# EAGLE schematic venti_ver2.0 (EAGLE 9.5.2)
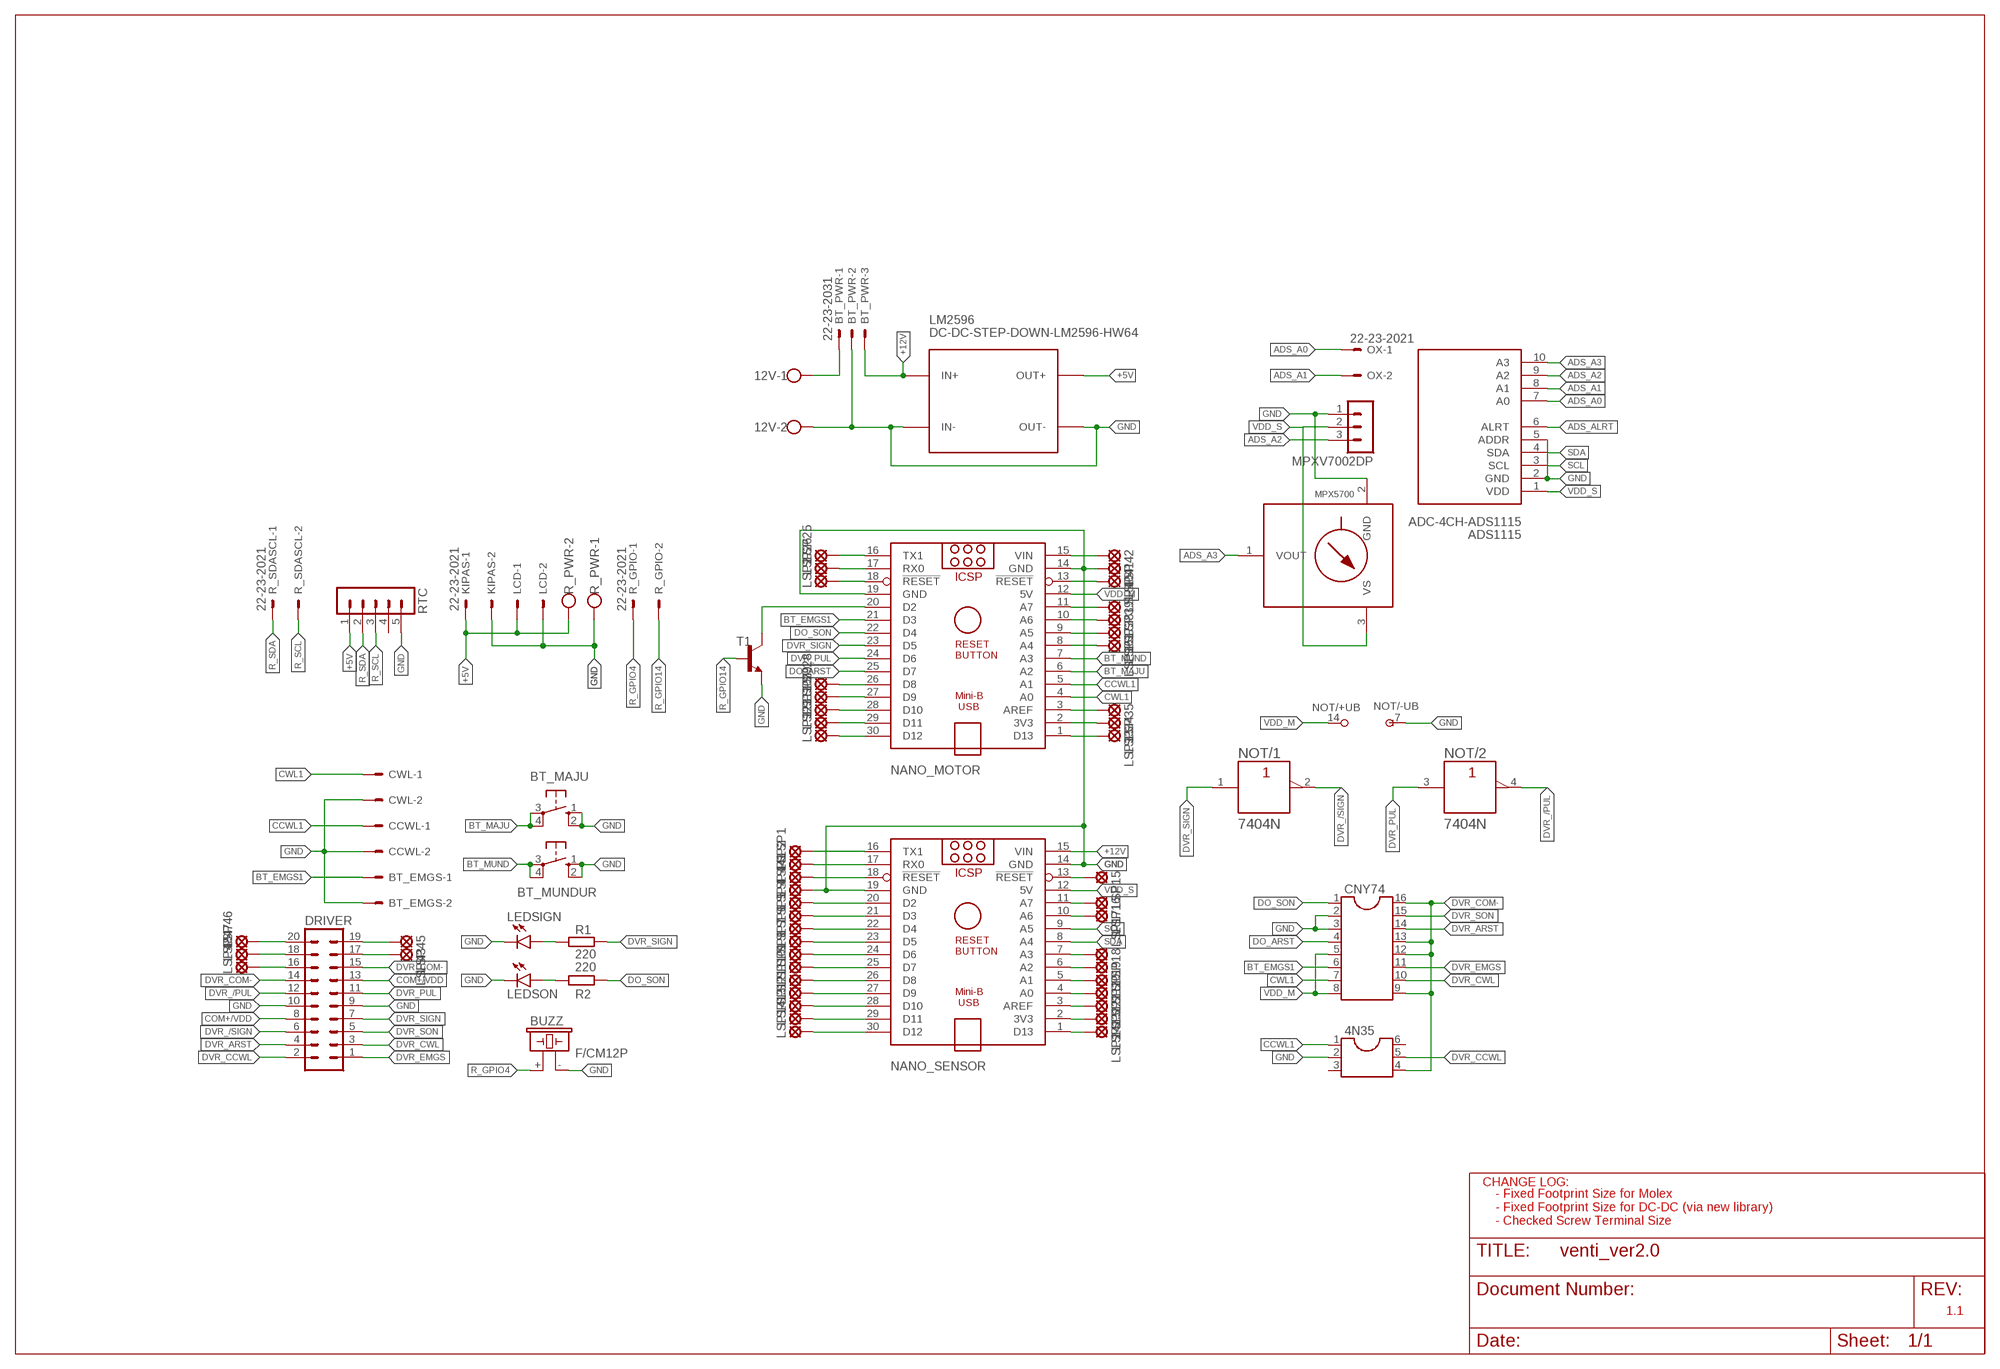
[diagram p0: schematic, sheet 1]

## Parts
4N35  DIL6  [DIL06]
12V  W237-102  [W237-102]
ADS1115  ADC-4CH-ADS1115  [ADC-4CH-ADS1115]
BT_EMGS  22-23-2021  [22-23-2021]
BT_MAJU  40-XX  [B3F-40XX]
BT_MUNDUR  40-XX  [B3F-40XX]
BT_PWR  22-23-2031  [22-23-2031]
BUZZ  F/CM12P  [F/CM12P]
CCWL  22-23-2021  [22-23-2021]
CNY74  DIL16  [DIL16]
CWL  22-23-2021  [22-23-2021]
DRIVER  ML20  [ML20]
KIPAS  22-23-2021  [22-23-2021]
LCD  22-23-2021  [22-23-2021]
LEDSIGN  LED5MM  [LED5MM]
LEDSON  LED5MM  [LED5MM]
LM2596  DC-DC-STEP-DOWN-LM2596-HW64  [DC-DC-STEP-DOWN-LM2596]
LSP1  LSP11  [LSP11]
LSP2  LSP11  [LSP11]
LSP3  LSP11  [LSP11]
LSP4  LSP11  [LSP11]
LSP5  LSP11  [LSP11]
LSP6  LSP11  [LSP11]
LSP7  LSP11  [LSP11]
LSP8  LSP11  [LSP11]
LSP9  LSP11  [LSP11]
LSP10  LSP11  [LSP11]
LSP11  LSP11  [LSP11]
LSP12  LSP11  [LSP11]
LSP13  LSP11  [LSP11]
LSP14  LSP11  [LSP11]
LSP15  LSP11  [LSP11]
LSP16  LSP11  [LSP11]
LSP17  LSP11  [LSP11]
LSP18  LSP11  [LSP11]
LSP19  LSP11  [LSP11]
LSP20  LSP11  [LSP11]
LSP21  LSP11  [LSP11]
LSP22  LSP11  [LSP11]
LSP23  LSP11  [LSP11]
LSP24  LSP11  [LSP11]
LSP25  LSP11  [LSP11]
LSP26  LSP11  [LSP11]
LSP27  LSP11  [LSP11]
LSP28  LSP11  [LSP11]
LSP29  LSP11  [LSP11]
LSP30  LSP11  [LSP11]
LSP31  LSP11  [LSP11]
LSP32  LSP11  [LSP11]
LSP33  LSP11  [LSP11]
LSP34  LSP11  [LSP11]
LSP35  LSP11  [LSP11]
LSP36  LSP11  [LSP11]
LSP37  LSP11  [LSP11]
LSP38  LSP11  [LSP11]
LSP39  LSP11  [LSP11]
LSP40  LSP11  [LSP11]
LSP41  LSP11  [LSP11]
LSP42  LSP11  [LSP11]
LSP43  LSP11  [LSP11]
LSP44  LSP11  [LSP11]
LSP45  LSP11  [LSP11]
LSP46  LSP11  [LSP11]
LSP47  LSP11  [LSP11]
LSP48  LSP11  [LSP11]
MPX5700  MPX-867B-H  [867B-H]
MPXV7002DP  MA03-1  [MA03-1]
NANO_MOTOR  ARDUINO_NANO  [ARDUINO_NANO]
NANO_SENSOR  ARDUINO_NANO  [ARDUINO_NANO]
NOT  7404N  [DIL14]
OX  22-23-2021  [22-23-2021]
R1  220  R-EU_0204/7  [0204/7]
R2  220  R-EU_0204/7  [0204/7]
R_GPIO  22-23-2021  [22-23-2021]
R_PWR  W237-102  [W237-102]
R_SDASCL  22-23-2021  [22-23-2021]
RTC  MA05-1  [MA05-1]
T1  2N2222-NPN-TO92-EBC  [TO92-EBC]

## Nets
+5V: KIPAS.1 LCD.1 LM2596.OUT+ R_PWR.2 RTC.1
+12V: BT_PWR.3 LM2596.IN+ NANO_SENSOR.15(VIN)
ADS_A0: ADS1115.7(A0) OX.1
ADS_A1: ADS1115.8(A1) OX.2
ADS_A2: ADS1115.9(A2) MPXV7002DP.3
ADS_A3: ADS1115.10(A3) MPX5700.1(VOUT)
ADS_ALRT: ADS1115.6(ALRT)
BT_EMGS1: BT_EMGS.1 CNY74.6 NANO_MOTOR.21(D3)
BT_MAJU: BT_MAJU.3(P) BT_MAJU.4(P1) NANO_MOTOR.6(A2)
BT_MUND: BT_MUNDUR.3(P) BT_MUNDUR.4(P1) NANO_MOTOR.7(A3)
CCWL1: 4N35.1 CCWL.1 NANO_MOTOR.5(A1)
COM+/VDD: DRIVER.8 DRIVER.13
CWL1: CNY74.7 CWL.1 NANO_MOTOR.4(A0)
DO_ARST: CNY74.4 NANO_MOTOR.25(D7)
DO_SON: CNY74.1 NANO_MOTOR.22(D4) R2.2
DVR_/PUL: DRIVER.12 NOT.4(/2:Y)
DVR_/SIGN: DRIVER.6 NOT.2(/1:Y)
DVR_ARST: CNY74.14 DRIVER.4
DVR_CCWL: 4N35.5 DRIVER.2
DVR_COM-: 4N35.4 CNY74.9 CNY74.12 CNY74.13 CNY74.16 DRIVER.14 DRIVER.15
DVR_CWL: CNY74.10 DRIVER.3
DVR_EMGS: CNY74.11 DRIVER.1
DVR_PUL: DRIVER.11 NANO_MOTOR.24(D6) NOT.3(/2:A)
DVR_SIGN: DRIVER.7 NANO_MOTOR.23(D5) NOT.1(/1:A) R1.2
DVR_SON: CNY74.15 DRIVER.5
GND: 4N35.2 12V.2 ADS1115.2(GND) ADS1115.5(ADDR) BT_EMGS.2 BT_MAJU.1(S) BT_MAJU.2(S1) BT_MUNDUR.1(S) BT_MUNDUR.2(S1) BT_PWR.2 BUZZ.- CCWL.2 CNY74.2 CNY74.3 CWL.2 DRIVER.9 DRIVER.10 KIPAS.2 LCD.2 LEDSIGN.K(C) LEDSON.K(C) LM2596.IN- LM2596.OUT- LSP41.MP LSP44.MP MPX5700.2(GND) MPXV7002DP.1 NANO_MOTOR.14(GND) NANO_MOTOR.19(GND) NANO_SENSOR.14(GND) NANO_SENSOR.19(GND) NOT.7(/-UB:-UB) R_PWR.1 RTC.5 T1.E
N$1: NANO_MOTOR.20(D2) T1.C
N$2: LEDSIGN.A R1.1
N$3: LEDSON.A R2.1
N$4: 12V.1 BT_PWR.1
N$5: LSP1.MP NANO_SENSOR.16(TX1)
N$6: LSP2.MP NANO_SENSOR.17(RX0)
N$7: LSP3.MP NANO_SENSOR.18(!RESET)
N$8: LSP4.MP NANO_SENSOR.20(D2)
N$9: LSP5.MP NANO_SENSOR.21(D3)
N$10: LSP6.MP NANO_SENSOR.22(D4)
N$11: LSP7.MP NANO_SENSOR.23(D5)
N$12: LSP8.MP NANO_SENSOR.24(D6)
N$13: LSP9.MP NANO_SENSOR.25(D7)
N$14: LSP10.MP NANO_SENSOR.26(D8)
N$15: LSP11.MP NANO_SENSOR.27(D9)
N$16: LSP12.MP NANO_SENSOR.28(D10)
N$17: LSP13.MP NANO_SENSOR.29(D11)
N$18: LSP14.MP NANO_SENSOR.30(D12)
N$19: LSP15.MP NANO_SENSOR.13(!RESET)
N$20: LSP16.MP NANO_SENSOR.11(A7)
N$21: LSP17.MP NANO_SENSOR.10(A6)
N$22: LSP18.MP NANO_SENSOR.7(A3)
N$23: LSP19.MP NANO_SENSOR.6(A2)
N$24: LSP20.MP NANO_SENSOR.5(A1)
N$25: LSP21.MP NANO_SENSOR.4(A0)
N$26: LSP22.MP NANO_SENSOR.3(AREF)
N$27: LSP23.MP NANO_SENSOR.2(3V3)
N$28: LSP24.MP NANO_SENSOR.1(D13)
N$29: LSP25.MP NANO_MOTOR.16(TX1)
N$30: LSP26.MP NANO_MOTOR.17(RX0)
N$31: LSP27.MP NANO_MOTOR.18(!RESET)
N$32: LSP28.MP NANO_MOTOR.26(D8)
N$33: LSP29.MP NANO_MOTOR.27(D9)
N$34: LSP30.MP NANO_MOTOR.28(D10)
N$35: LSP31.MP NANO_MOTOR.29(D11)
N$36: LSP32.MP NANO_MOTOR.30(D12)
N$37: LSP33.MP NANO_MOTOR.1(D13)
N$38: LSP34.MP NANO_MOTOR.2(3V3)
N$39: LSP35.MP NANO_MOTOR.3(AREF)
N$40: LSP36.MP NANO_MOTOR.8(A4)
N$41: LSP37.MP NANO_MOTOR.9(A5)
N$42: LSP38.MP NANO_MOTOR.10(A6)
N$43: LSP39.MP NANO_MOTOR.11(A7)
N$44: LSP40.MP NANO_MOTOR.13(!RESET)
N$45: LSP42.MP NANO_MOTOR.15(VIN)
N$55: DRIVER.17 LSP43.MP
N$56: DRIVER.19 LSP45.MP
N$63: DRIVER.16 LSP48.MP
N$64: DRIVER.18 LSP47.MP
N$65: DRIVER.20 LSP46.MP
R_GPIO4: BUZZ.+ R_GPIO.1
R_GPIO14: R_GPIO.2 T1.B
R_SCL: R_SDASCL.2 RTC.3
R_SDA: R_SDASCL.1 RTC.2
SCL: ADS1115.3(SCL) NANO_SENSOR.9(A5)
SDA: ADS1115.4(SDA) NANO_SENSOR.8(A4)
VDD_M: CNY74.5 CNY74.8 NANO_MOTOR.12(5V) NOT.14(/+UB:+UB)
VDD_S: ADS1115.1(VDD) MPX5700.3(VS) MPXV7002DP.2 NANO_SENSOR.12(5V)
Unconnected: 4N35.3 4N35.6 MPX5700.4(NC) MPX5700.5(NC) MPX5700.6(NC) NOT.5(/3:A) NOT.6(/3:Y) NOT.8(/4:Y) NOT.9(/4:A) NOT.10(/5:Y) NOT.11(/5:A) NOT.12(/6:Y) NOT.13(/6:A) RTC.4

## Notes on the sheet
- CHANGE LOG:
- - Fixed Footprint Size for Molex
  - Fixed Footprint Size for DC-DC (via new library)
  - Checked Screw Terminal Size
- 1.1

## Library data of the parts
4N35 = ic-package:DIL6: Dual In Line / Socket
12V R_PWR = con-wago-500:W237-102: WAGO SCREW CLAMP; MPN: 237-102; OC_FARNELL: unknown; OC_NEWARK: 70K9898
ADS1115 = diy-modules:ADC-4CH-ADS1115: 4 Channel 16-Bit Analog-to-Digital Converter based on ADS1115 chip Arduino ADS1115 Getting Started Tutorial is available here: http://henrysbench.capnfatz.com/henrys-bench/arduino-voltage-measurements/arduino-ads1115-module-getting-started-tutorial/ ADS1115 datasheet is available here: http://www.ti.com/lit/ds/symlink/ads1115.pdf Click here to find device on ebay.com <http://www.ebay.com/sch/ads1115+module>
BT_EMGS CCWL CWL KIPAS LCD OX R_GPIO R_SDASCL = con-molex:22-23-2021: .100" (2.54mm) Center Header - 2 Pin; MF: MOLEX; MPN: 22-23-2021; OC_FARNELL: 1462926; OC_NEWARK: 25C3832
BT_MAJU BT_MUNDUR = switch-omron:40-XX: OMRON SWITCH; MF: OMRON COMPONENTS USA; MPN: B3F-4000; OC_FARNELL: 176434; OC_NEWARK: 36K3105
BT_PWR = con-molex:22-23-2031: .100" (2.54mm) Center Header - 3 Pin; MF: MOLEX; MPN: 22-23-2031; OC_FARNELL: 1462950; OC_NEWARK: 30C0862
BUZZ = buzzer:F/CM12P: BUZZER Source: Buerklin; OC_FARNELL: unknown; OC_NEWARK: unknown
CNY74 = ic-package:DIL16: Dual In Line / Socket
DRIVER = con-harting-ml:ML20: HARTING; OC_FARNELL: unknown; OC_NEWARK: unknown
LEDSIGN LEDSON = led:LED: LED OSRAM: - CHIPLED LG R971, LG N971, LY N971, LG Q971, LY Q971, LO R971, LY R971 LH N974, LH R974 LS Q976, LO Q976, LY Q976 LO Q996 - Hyper CHIPLED LW Q18S LB Q993, LB Q99A, LB R99A - SideLED LS A670, LO A670, LY A670, LG A670, LP A670 LB A673, LV A673, LT A673, LW A673 LH A674 LY A675 LS A676, LA A676, LO A676, LY A676, LW A676 LS A679, LY A679, LG A679 - Hyper Micro SIDELED® LS Y876, LA Y876, LO Y876, LY Y876 LT Y87S - SmartLED LW L88C, LW L88S LB L89C, LB L89S, LG L890 LS L89K, LO L89K, LY L89K LS L896, LA L896, LO L896, LY L896 - TOPLED LS T670, LO T670, LY T670, LG T670, LP T670 LSG T670, LSP T670, LSY T670, LOP T670, LYG T670 LG T671, LOG T671, LSG T671 LB T673, LV T673, LT T673, LW T673 LH T674 LS T676, LA T676, LO T676, LY T676, LB T676, LH T676, LSB T676, LW T676 LB T67C, LV T67C, LT T67C, LS T67K, LO T67K, LY T67K, LW E67C LS E67B, LA E67B, LO E67B, LY E67B, LB E67C, LV E67C, LT E67C LW T67C LS T679, LY T679, LG T679 LS T770, LO T770, LY T770, LG T770, LP T770 LB T773, LV T773, LT T773, LW T773 LH T774 LS E675, LA E675, LY E675, LS T675 LS T776, LA T776, LO T776, LY T776, LB T776 LHGB T686 LT T68C, LB T68C - Hyper Mini TOPLED® LB M676 - Mini TOPLED Santana® LG M470 LS M47K, LO M47K, LY M47K Source: http://www.osram.convergy.de LUXEON: - LUMILED® LXK2-PW12-R00, LXK2-PW12-S00, LXK2-PW14-U00, LXK2-PW14-V00 LXK2-PM12-R00, LXK2-PM12-S00, LXK2-PM14-U00 LXK2-PE12-Q00, LXK2-PE12-R00, LXK2-PE12-S00, LXK2-PE14-T00, LXK2-PE14-U00 LXK2-PB12-K00, LXK2-PB12-L00, LXK2-PB12-M00, LXK2-PB14-N00, LXK2-PB14-P00, LXK2-PB14-Q00 LXK2-PR12-L00, LXK2-PR12-M00, LXK2-PR14-Q00, LXK2-PR14-R00 LXK2-PD12-Q00, LXK2-PD12-R00, LXK2-PD12-S00 LXK2-PH12-R00, LXK2-PH12-S00 LXK2-PL12-P00, LXK2-PL12-Q00, LXK2-PL12-R00 Source: www.luxeon.com KINGBRIGHT: KA-3528ASYC Source: www.kingbright.com
LM2596 = lm2596-HW64-pras:DC-DC-STEP-DOWN-LM2596-HW64: DC/DC Step-Down Regulator based on LM2596-ADJ chip Modified DC/DC Step Down Regulator by Prasetyo W. to accomodate for LM2596 HW-64 alternative. Length 53.52 Width 24.11
LSP1-LSP48 = solpad:LSP11: SOLDER PAD drill 1.1 mm
MPX5700 = mpx-freescale:MPX*****: Generic MPX pressure sensor
MPXV7002DP = con-lstb:MA03-1: PIN HEADER; OC_FARNELL: unknown; OC_NEWARK: unknown
NANO_MOTOR NANO_SENSOR = ArduinoNanoV30:ARDUINO_NANO: Arduino Nano V3.0 Overview: The Arduino Nano is a small, complete, and breadboard-friendly board based on the ATmega328 (Arduino Nano 3.x) or ATmega168 (Arduino Nano 2.x). It has more or less the same functionality of the Arduino Duemilanove, but in a different package. It lacks only a DC power jack, and works with a Mini-B USB cable instead of a standard one. The Nano was designed and is being produced by Gravitech. Specifications: Microcontroller Atmel ATmega168 or ATmega328 Operating Voltage (logic level) 5 V Input Voltage (recommended) 7-12 V Input Voltage (limits) 6-20 V Digital I/O Pins 14 (of which 6 provide PWM output) Analog Input Pins 8 DC Current per I/O Pin 40 mA Flash Memory 16 KB (ATmega168) or 32 KB (ATmega328) of which 2 KB used by bootloader SRAM 1 KB (ATmega168) or 2 KB (ATmega328) EEPROM 512 bytes (ATmega168) or 1 KB (ATmega328) Clock Speed 16 MHz Dimensions 0.73" x 1.70" Length 45 mm Width 18 mm Weigth 5 g Power: The Arduino Nano can be powered via the Mini-B USB connection, 6-20V unregulated external power supply (pin 30), or 5V regulated external power supply (pin 27). The power source is automatically selected to the highest voltage source. Memory: The ATmega168 has 16 KB of flash memory for storing code (of which 2 KB is used for the bootloader); the ATmega328 has 32 KB, (also with 2 KB used for the bootloader). The ATmega168 has 1 KB of SRAM and 512 bytes of EEPROM (which can be read and written with the EEPROM library); the ATmega328 has 2 KB of SRAM and 1 KB of EEPROM. Input and Output: Each of the 14 digital pins on the Nano can be used as an input or output, using pinMode(), digitalWrite(), and digitalRead() functions. They operate at 5 volts. Each pin can provide or receive a maximum of 40 mA and has an internal pull-up resistor (disconnected by default) of 20-50 kOhms. In addition, some pins have specialized functions. Visit Arduino - ArduinoBoardNano <https://www.arduino.cc/en/Main/ArduinoBoardNano>
NOT = 74ttl-din:74*04: Hex INVERTER
R1 R2 = rcl:R-EU_: RESISTOR, European symbol; SPICEPREFIX: R
RTC = con-lstb:MA05-1: PIN HEADER; OC_FARNELL: unknown; OC_NEWARK: unknown
T1 = transistor-neu-to92:*-NPN-: NPN Transistror